# Altium schematic sheet MEMS.SchDoc: MEMS
size A4; Date: Not used; ApprovedBy: Not used; CheckedBy: Not used; Author: Not used; CompanyName: STMicroelectronics; DrawnBy: Not used; Engineer: Not used; Organization: Not used; Address1: Not used; Address2: Not used; Address3: Not used; Address4: Not used; DocumentNumber: Not used; Revision: Not used; SheetNumber: 12; SheetTotal: 16; CurrentTime: Not used; CurrentDate: Not used; Time: Not used; DocumentFullPathAndName: Not used; DocumentName: Not used; ModifiedDate: Not used; ImagePath: Not used; ProjectName: Not used; Application_BuildNumber: Not used
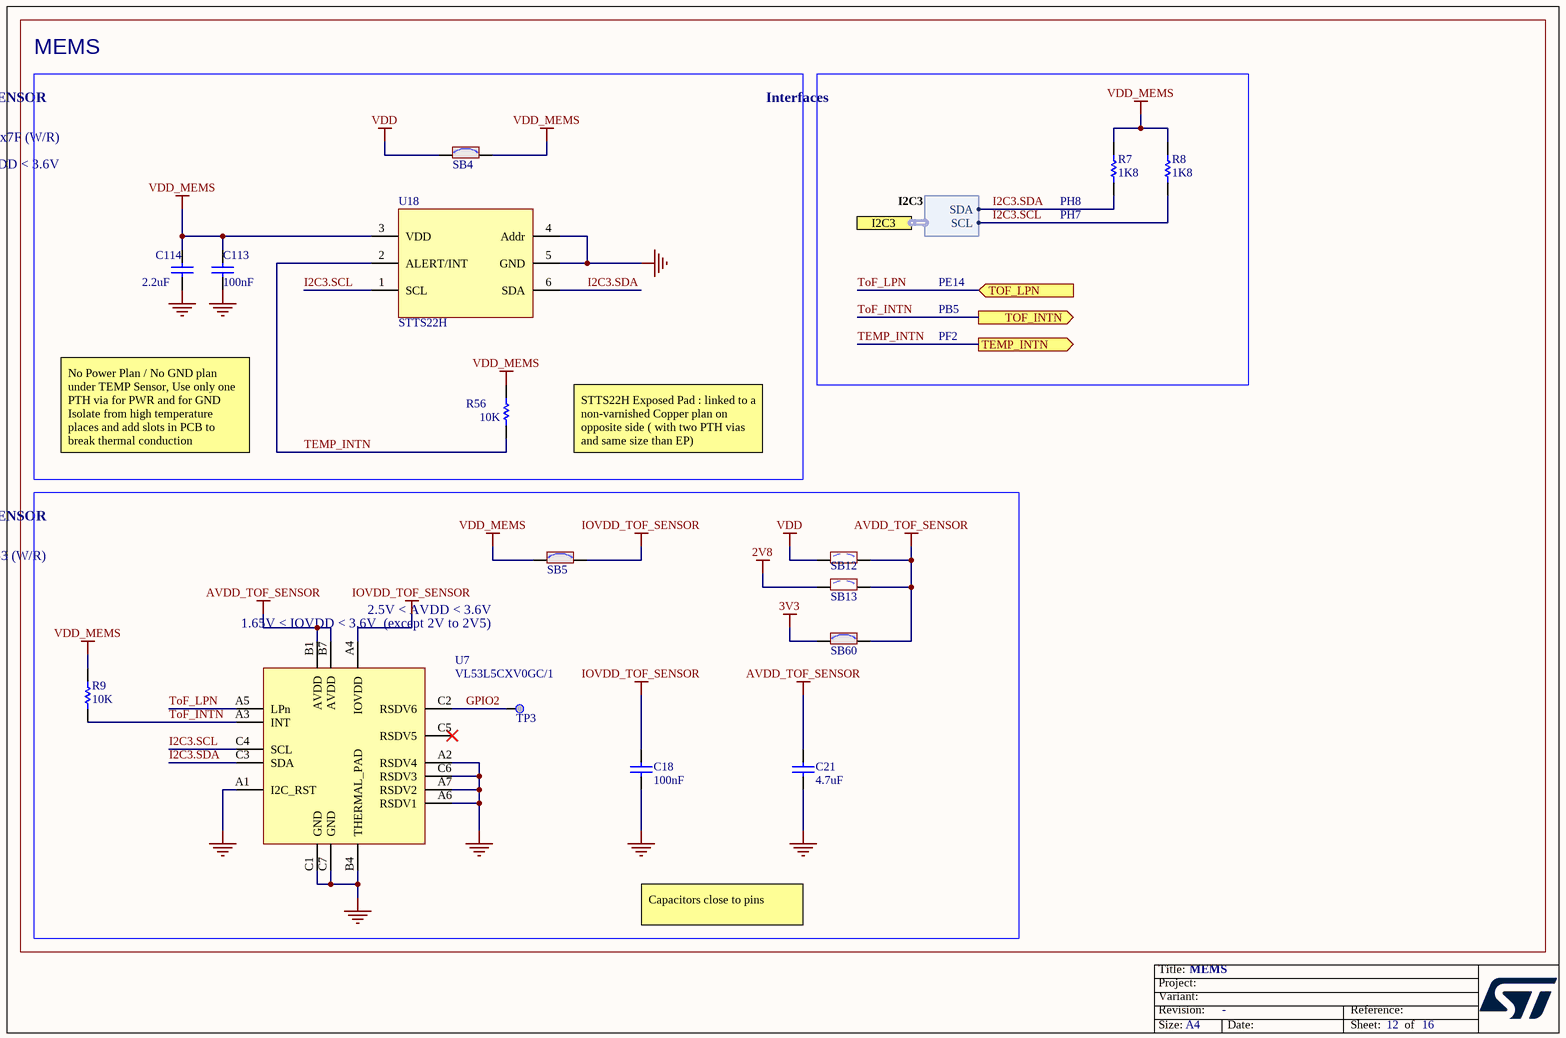
[diagram p0: MEMS.SchDoc]

## Parts
C18  value 100nF  [C0603]  (hidden comment: Capacitor)
C21  value 4.7uF  [C0603_H0P8]  (hidden comment: Capacitor)
C113  value 100nF  [C0603]  (hidden comment: Capacitor)
C114  value 2.2uF  [C0603]  (hidden comment: Capacitor)
R7  value 1K8  [R0402]  (hidden comment: Resistor)
R8  value 1K8  [R0402]  (hidden comment: Resistor)
R9  value 10K  [R0603]  (hidden comment: Resistor)
R56  value 10K  [R0603]  (hidden comment: Resistor)
SB4  SB_ON  [SOLDER-BRIDGE_R0402-0R]  (value not drawn)
SB5  SB_ON  [SOLDER-BRIDGE_R0402-0R]  (value not drawn)
SB12  SB_OFF  [SOLDER-BRIDGE_R0402-0R]  (value not drawn)
SB13  SB_OFF  [SOLDER-BRIDGE_R0402-0R]  (value not drawn)
SB60  SB_ON  [SOLDER-BRIDGE_R0402-0R]  (value not drawn)
TP3  Test Point  [TP_SMD_1MM]  (value not drawn)  (no BOM)
U7  VL53L5CXV0GC/1  [ICC_LGA16_6P4X3_P075_H1P5]
U18  STTS22H  [ICC_UDFN6-EPAD_2X2_P065]

## Blocks framed on the sheet
MEMS: C113 C114 R56 SB4 U18
Interfaces: R7 R8
TIME OF FLIGHT SENSOR: C18 C21 R9 SB5 SB12 SB13 SB60 TP3 U7

## Ports
I2C3 (harness I2C3), TEMP_INTN (out), TOF_INTN (out), TOF_LPN (in)

## Harnesses
I2C3: SDA, SCL

## Nets
2V8: SB13.1
3V3: SB60.1
AVDD_TOF_SENSOR: C21.2 SB12.2 SB13.2 SB60.2 U7.B1(AVDD) U7.B7(AVDD)
GND: C18.2 C21.1 C113.2 C114.1 U7.A1(I2C_RST) U7.A2(RSDV4) U7.A6(RSDV1) U7.A7(RSDV2) U7.B4(THERMAL_PAD) U7.C1(GND) U7.C6(RSDV3) U7.C7(GND) U18.4(Addr) U18.5(GND)
IOVDD_TOF_SENSOR: C18.1 SB5.2 U7.A4(IOVDD)
VDD: SB4.1 SB12.1
VDD_MEMS: C113.1 C114.2 R7.2 R8.2 R9.2 R56.2 SB4.2 SB5.1 U18.3(VDD)
GPIO2: TP3.1 U7.C2(RSDV6)
I2C3.SCL: R8.1 U7.C4(SCL) U18.1(SCL) ; port I2C3.SCL
I2C3.SDA: R7.1 U7.C3(SDA) U18.6(SDA) ; port I2C3.SDA
TEMP_INTN: R56.1 U18.2(ALERT/INT) ; port TEMP_INTN
ToF_INTN: R9.1 U7.A3(INT) ; port TOF_INTN
ToF_LPN: U7.A5(LPn) ; port TOF_LPN

Not connected (* = marked no-connect by the designer): U7 C5(RSDV5)*

## Notes on the sheet
- TEMPERATURE SENSOR
- 1.5V < VDD < 3.6V
- I2C Default address : 0x7E / 0x7F (W/R)
- (near R7) PH7
- (near R7) PH8
- PE14
- PB5
- PF2
- No Power Plan / No GND plan under TEMP Sensor, Use only one PTH via for PWR and for GND
  Isolate from high temperature places and add slots in PCB to break thermal conduction
- STTS22H Exposed Pad : linked to a non-varnished Copper plan on opposite side ( with two PTH vias and same size than EP)
- I2C Default address : 0x52 / 0x53 (W/R)
- 1.65V < IOVDD < 3.6V  (except 2V to 2V5)
- (near SB5) 2.5V < AVDD < 3.6V
- Capacitors close to pins
- Title:
- Project:
- Size:
- Revision:
- Variant:
- A4
- -
- Date:
- Reference:
- Sheet:
- of

## Library data of the parts
C18 C113 = MCD-00211: Capacitor, MLCC, 100nF, 16V, X7R, +/-10%, 0603, T=0.8mm; Manufacturer_Part_Number: CC0603KRX7R7BB104; Manufacturer: YAGEO; Part_Preference: Recommended; Order_Code_RS: 669-8763; Internal_Part_Number: MCD-00211; Status: Released; Part_Type: Capacitor; Package: 0603; ComponentLink1URL: http://tunmcdsvn.tun.st.com/Component_Documentation_Library/Trunk/Capacitor/YAGEO_X7R_Series; Alternate_Manufacturer: N/A; Alternate_Manufacturer_Part_Number: N/A; Order_Code_Digikey: 311-1088-1-ND; Order_Code_Farnell: 432210
C21 = MCD-01721: Capacitor, MLCC, 4.7uF, 10V, X5R, +/-10%, 0603, T=0.8mm; Part_Preference: Recommended; Manufacturer: YAGEO; Manufacturer_Part_Number: CC0603KRX5R6BB475; Internal_Part_Number: MCD-01721; Status: Released; Part_Type: Capacitor; Alternate_Manufacturer: N/A; Alternate_Manufacturer_Part_Number: N/A; Package: 0603; ComponentLink1URL: http://tunmcdsvn.tun.st.com/Component_Documentation_Library/Trunk/Capacitor/YAGEO_X5R_Series; Order_Code_Digikey: 311-1455-1-ND; Order_Code_Farnell: 1458898; Order_Code_RS: N/A
C114 = MCD-00012: Capacitor, MLCC, 2.2uF, 10V, X5R, +/- 10%, 0603, T=0.8mm; BMS_Part_Number: 9142010; Part_Preference: Recommended; Manufacturer: YAGEO; Manufacturer_Part_Number: CC0603KRX5R6BB225; Alternate_Manufacturer: KEMET; Alternate_Manufacturer_Part_Number: C0603C225K8PACTU; Internal_Part_Number: MCD-00012; Status: Released; Part_Type: Capacitor; Package: 0603; ComponentLink1URL: http://tunmcdsvn.tun.st.com/Component_Documentation_Library/Trunk/Capacitor/YAGEO_X5R_Series; Order_Code_Digikey: 311-1451-1-ND; Order_Code_Farnell: 2370679; Order_Code_RS: N/A
R7 R8 = MCD-00409: Resistor, 1K8, 0402, +/-1%, 1/16W; Manufacturer_Part_Number: RC0402FR-071K8L; Manufacturer: YAGEO; Part_Preference: Recommended; Component_Country_Of_Origin: China; Internal_Part_Number: MCD-00409; Status: Released; Part_Type: Resistor; Package: 0402; ComponentLink1URL: http://tunmcdsvn.tun.st.com/Component_Documentation_Library/Trunk/Resistor/YAGEO_RC_L_Series; Order_Code_Digikey: 311-1.80KLRCT-ND; Order_Code_Farnell: 9239260; Order_Code_RS: N/A
R9 R56 = MCD-00220: Resistor, 10K, 0603, +/-1%, 1/10W; Manufacturer_Part_Number: RC0603FR-0710KL; Manufacturer: YAGEO; Part_Preference: Recommended; Internal_Part_Number: MCD-00220; Status: Released; Part_Type: Resistor; Package: 0603; ComponentLink1URL: http://tunmcdsvn.tun.st.com/Component_Documentation_Library/Trunk/Resistor/YAGEO_RC_L_Series; Alternate_Manufacturer: N/A; Alternate_Manufacturer_Part_Number: N/A; Order_Code_Digikey: 311-10.0KHRCT-ND; Order_Code_Farnell: 9238603; Order_Code_RS: N/A
SB4 SB5 SB60 = MCD-01618: Solder Bridge 0402 ON; Part_Type: Misc; Manufacturer_Part_Number: RC0402JR-070RL; Manufacturer: YAGEO; Part_Preference: Recommended; Order_Code_RS: 618-5804; Component_Country_Of_Origin: China; Internal_Part_Number: MCD-01618; Status: Released; Package: SB0402; ComponentLink1URL: http://tunmcdsvn.tun.st.com/Component_Datasheet_Library/Trunk/Resistors/Yageo_Resistor_RC0402-series; Order_Code_Digikey: 311-0.0JRTR-ND; Order_Code_Farnell: 2363467
SB12 = MCD-02162: Solder Bridge 0402 OFF; Part_Type: Misc; Manufacturer_Part_Number: RC0402JR-070RL; Manufacturer: YAGEO; Part_Preference: Recommended; Order_Code_RS: 618-5804; Component_Country_Of_Origin: China; Internal_Part_Number: MCD-02162; Status: Checked; Package: SB0402; ComponentLink1URL: http://tunmcdsvn.tun.st.com/Component_Datasheet_Library/Trunk/Resistors/Yageo_Resistor_RC0402-series; Order_Code_Digikey: 311-0.0JRTR-ND; Order_Code_Farnell: 2363467
SB13 = MCD-02162: Solder Bridge 0402 OFF; Part_Type: Misc; Manufacturer_Part_Number: RC0402JR-070RL; Manufacturer: YAGEO; Part_Preference: Recommended; Order_Code_RS: 618-5804; Component_Country_Of_Origin: China; ShowFields: YES; ID: 4262; Internal_Part_Number: MCD-02162; Status: Released; Package: SB0402; ComponentLink1URL: http://tunmcdsvn.tun.st.com/Component_Datasheet_Library/Trunk/Resistors/Yageo_Resistor_RC0402-series; Order_Code_Digikey: 311-0.0JRTR-ND; Order_Code_Farnell: 2363467
TP3 = MCD-00074: Test Point 1mm; Part_Type: Misc; Part_Preference: Recommended; Internal_Part_Number: MCD-00074; Status: Released; Manufacturer_Part_Number: n/a; Manufacturer: N/A; ComponentLink1URL: http://na
U7 = MCD-02590: Time-of-Flight 8x8 multizone ranging sensor with wide field of view; Part_Type: IC; Part_Preference: Recommended; Manufacturer: STMICROELECTRONICS; ShowFields: YES; ID: 4696; Internal_Part_Number: MCD-02590; Value: VL53L5CXV0GC/1; Status: New; Manufacturer_Part_Number: VL53L5CXV0GC/1; Package: Optical LGA16; ComponentLink1URL: http://tunmcdsvn.tun.st.com/Component_Documentation_Library/Trunk/IC/STMICROELECTRONICS_VL53L5CX; Order_Code_Digikey: N/A; Order_Code_Farnell: N/A; Order_Code_RS: N/A
U18 = MCD-02159: temperature sensor; Part_Type: IC; Part_Preference: Recommended; Manufacturer: STMICROELECTRONICS; Manufacturer_HQ_COO: EU; Order_code_RS: 194-7646; Component_Country_Of_Origin: Thailand; Value: STTS22H; Order_code_Digikey: 497-STTS22HTR-ND; Order_code_Farnell: 3265386; Status: Checked; ComponentLink1URL: http://tunmcdsvn.tun.st.com/Component_Datasheet_Library/Trunk/IC/STM_MEMS_STTS22H; Internal_Part_Number: MCD-02159; Manufacturer_Part_Number: STTS22H; Alternate_Manufacturer: N/A; Alternate_Manufacturer_Part_Number: N/A; Package: UDFN 6-pins 2x2x0.5mm